# Altium schematic sheet RASPBERRY_PI.SchDoc
size A
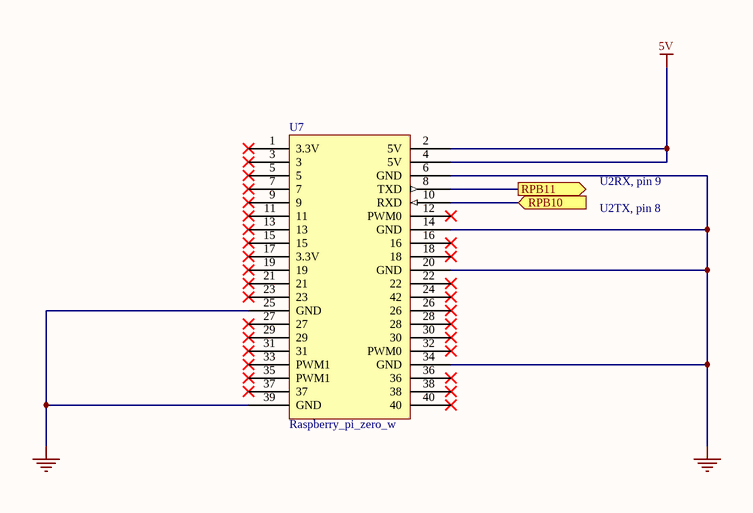
[diagram p0: RASPBERRY_PI.SchDoc]

## Parts
U7  Raspberry_pi_zero_w  [RASPB]

## Ports
RPB10 (in), RPB11 (out)

## Nets
5V: U7.2(5V) U7.4(5V)
GND: U7.6(GND) U7.14(GND) U7.20(GND) U7.25(GND) U7.34(GND) U7.39(GND)
RPB10: U7.10(RXD) ; port RPB10
RPB11: U7.8(TXD) ; port RPB11

Not connected (* = marked no-connect by the designer): U7 1(3.3V)* 3* 5* 7* 9* 11* 12(PWM0)* 13* 15* 16* 17(3.3V)* 18* 19* 21* 22* 23* 24(42)* 26* 27* 28* 29* 30* 31* 32(PWM0)* 33(PWM1)* 35(PWM1)* 36* 37* 38* 40*

## Notes on the sheet
- U2RX, pin 9
- U2TX, pin 8

## Library data of the parts
U7 = Raspberry_pi_zero_w: REF FABRIQUANT: X